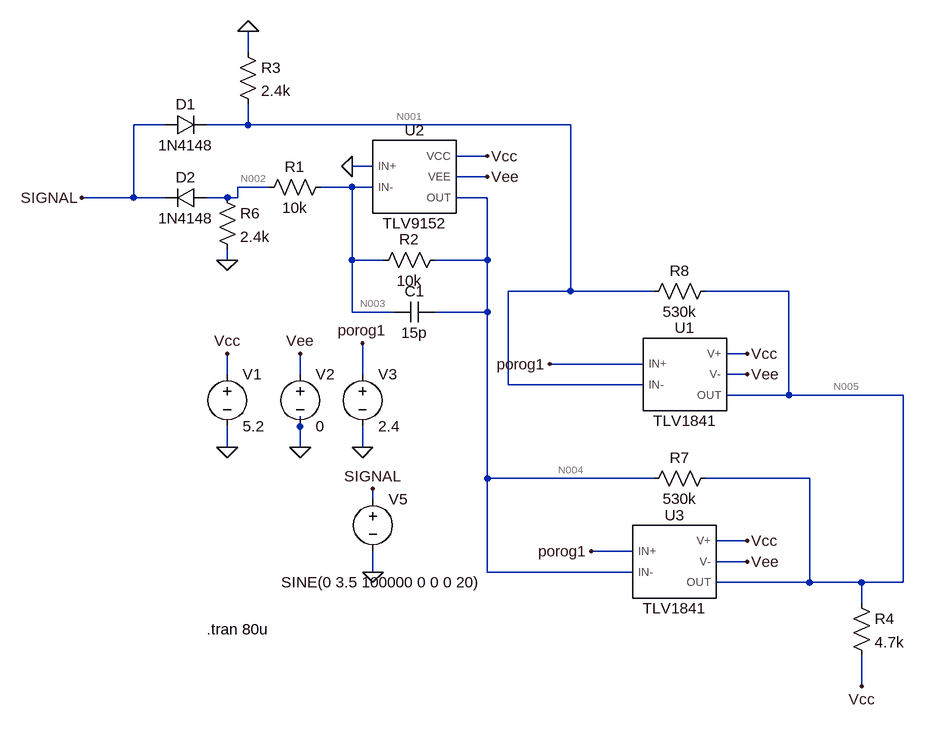
[diagram p0: schematic COmp.asc]
COmp.asc, the LTspice schematic file:
Version 4.1
SHEET 1 880 680
WIRE -528 -384 -528 -416
WIRE -656 -272 -704 -272
WIRE -528 -272 -528 -304
WIRE -528 -272 -592 -272
WIRE -32 -272 -528 -272
WIRE -160 -224 -208 -224
WIRE -336 -208 -368 -208
WIRE -160 -192 -208 -192
WIRE -496 -176 -544 -176
WIRE -368 -176 -416 -176
WIRE -336 -176 -368 -176
WIRE -704 -160 -704 -272
WIRE -704 -160 -784 -160
WIRE -656 -160 -704 -160
WIRE -560 -160 -592 -160
WIRE -544 -160 -544 -176
WIRE -544 -160 -560 -160
WIRE -160 -160 -208 -160
WIRE -560 -64 -560 -80
WIRE -368 -64 -368 -176
WIRE -320 -64 -368 -64
WIRE -160 -64 -160 -160
WIRE -160 -64 -240 -64
WIRE -32 -16 -32 -272
WIRE -32 -16 -128 -16
WIRE 96 -16 -32 -16
WIRE 304 -16 176 -16
WIRE -368 16 -368 -64
WIRE -304 16 -368 16
WIRE -160 16 -160 -64
WIRE -160 16 -240 16
WIRE 240 80 208 80
WIRE 80 96 -64 96
WIRE -560 112 -560 80
WIRE -448 112 -448 80
WIRE -352 112 -352 64
WIRE 240 112 208 112
WIRE -128 128 -128 -16
WIRE 80 128 -128 128
WIRE 304 144 304 -16
WIRE 304 144 208 144
WIRE 480 144 304 144
WIRE -448 192 -448 176
WIRE -560 224 -560 192
WIRE -448 224 -448 192
WIRE -352 224 -352 192
WIRE -160 272 -160 16
WIRE 96 272 -160 272
WIRE 336 272 176 272
WIRE -336 304 -336 288
WIRE 240 368 192 368
WIRE 64 384 0 384
WIRE 240 400 192 400
WIRE -336 416 -336 384
WIRE -160 416 -160 272
WIRE 64 416 -160 416
WIRE 336 432 336 272
WIRE 336 432 192 432
WIRE 416 432 336 432
WIRE 480 432 480 144
WIRE 480 432 416 432
WIRE 416 464 416 432
WIRE 416 592 416 544
FLAG -560 224 0
FLAG -448 224 0
FLAG -352 224 0
FLAG -560 80 Vcc
FLAG -448 80 Vee
FLAG -352 64 porog1
FLAG -336 288 SIGNAL
FLAG -336 416 0
FLAG -64 96 porog1
FLAG 240 80 Vcc
FLAG -368 -208 0
FLAG -784 -160 SIGNAL
FLAG 0 384 porog1
FLAG 240 112 Vee
FLAG 240 400 Vee
FLAG 240 368 Vcc
FLAG -160 -224 Vcc
FLAG -160 -192 Vee
FLAG -528 -416 0
FLAG -560 -64 0
FLAG 416 592 Vcc
DATAFLAG 368 144 ""
DATAFLAG 288 432 ""
DATAFLAG -368 -272 ""
DATAFLAG -160 -16 ""
DATAFLAG -576 -160 ""
DATAFLAG -736 -160 ""
DATAFLAG 16 128 ""
SYMBOL voltage -560 96 R0
WINDOW 123 0 0 Left 0
WINDOW 39 0 0 Left 0
SYMATTR InstName V1
SYMATTR Value 5.2
SYMBOL voltage -448 96 R0
WINDOW 123 0 0 Left 0
WINDOW 39 0 0 Left 0
SYMATTR InstName V2
SYMATTR Value 0
SYMBOL voltage -352 96 R0
WINDOW 123 0 0 Left 0
WINDOW 39 0 0 Left 0
SYMATTR InstName V3
SYMATTR Value 2.4
SYMBOL voltage -336 288 R0
WINDOW 123 0 0 Left 0
WINDOW 39 0 0 Left 0
WINDOW 3 -141 144 Left 2
SYMATTR InstName V5
SYMATTR Value SINE(0 3.5 100000 0 0 0 20)
SYMBOL TLV1841 144 112 R0
SYMATTR InstName U1
SYMBOL TLV9152 -272 -192 R0
SYMATTR InstName U2
SYMBOL res -400 -192 R90
WINDOW 0 0 56 VBottom 2
WINDOW 3 32 56 VTop 2
SYMATTR InstName R1
SYMATTR Value 10k
SYMBOL diode -656 -256 R270
WINDOW 0 32 32 VTop 2
WINDOW 3 0 32 VBottom 2
SYMATTR InstName D1
SYMATTR Value 1N4148
SYMBOL diode -592 -176 R90
WINDOW 0 0 32 VBottom 2
WINDOW 3 32 32 VTop 2
SYMATTR InstName D2
SYMATTR Value 1N4148
SYMBOL TLV1841 128 400 R0
SYMATTR InstName U3
SYMBOL res -224 -80 R90
WINDOW 0 0 56 VBottom 2
WINDOW 3 32 56 VTop 2
SYMATTR InstName R2
SYMATTR Value 10k
SYMBOL res -544 -400 R0
SYMATTR InstName R3
SYMATTR Value 2.4k
SYMBOL res 400 448 R0
SYMATTR InstName R4
SYMATTR Value 4.7k
SYMBOL res -576 -176 R0
SYMATTR InstName R6
SYMATTR Value 2.4k
SYMBOL cap -240 0 R90
WINDOW 0 0 32 VBottom 2
WINDOW 3 32 32 VTop 2
SYMATTR InstName C1
SYMATTR Value 15p
SYMBOL res 192 256 R90
WINDOW 0 0 56 VBottom 2
WINDOW 3 32 56 VTop 2
SYMATTR InstName R7
SYMATTR Value 530k
SYMBOL res 192 -32 R90
WINDOW 0 0 56 VBottom 2
WINDOW 3 32 56 VTop 2
SYMATTR InstName R8
SYMATTR Value 530k
TEXT -592 504 Left 2 !.tran 80u

The netlist it stands for:
* COmp.asc
V1 Vcc 0 5.2
V2 Vee 0 0
V3 porog1 0 2.4
V5 SIGNAL 0 SINE(0 3.5 100000 0 0 0 20)
X§U1 porog1 N001 Vcc Vee N005 TLV1841  ; pins IN+ IN- V+ V- OUT
X§U2 0 N003 Vcc Vee N004 TLV9152  ; pins IN+ IN- VCC VEE OUT
R1 N003 N002 10k
D1 SIGNAL N001 1N4148
D2 N002 SIGNAL 1N4148
X§U3 porog1 N004 Vcc Vee N005 TLV1841  ; pins IN+ IN- V+ V- OUT
R2 N004 N003 10k
R3 0 N001 2.4k
R4 N005 Vcc 4.7k
R6 N002 0 2.4k
C1 N004 N003 15p
R7 N005 N004 530k
R8 N005 N001 530k
.model D D
.lib standard.dio
.tran 80u
.lib C:\Users\User\Documents\LTspice\tlv1841.lib
.lib tlv9152.lib
.backanno
.end

* Results of the author's LTspice run, read from the files saved beside the schematic
* Operating Point, zero values left out:
*   V(n001) = 23.03 mV
*   V(n003) = 123.5 µV
*   V(vcc) = 5.2 V
*   V(porog1) = 2.4 V
*   V(n005) = 5.11 V
*   V(n004) = 223 µV
*   V(n002) = 23.9 µV
*   I(V1) = -729.2 µA
*   I(R2) = 9.947 nA
*   I(R4) = -19.24 µA
*   I(R7) = 9.64 µA
*   I(V3) = -999.2 pA
*   I(D1) = -1.004 nA
*   I(D2) = 1.33 pA
*   I(V5) = 1.005 nA
*   I(R3) = -9.596 µA
*   I(R6) = 9.959 nA
*   I(R8) = 9.597 µA
*   I(V2) = 719.6 µA
*   I(R1) = 9.96 nA
*   Ix(u2:in+) = -3 pA
*   Ix(u2:in-) = -13 pA
*   Ix(u2:vcc) = 560 µA
*   Ix(u2:vee) = -569.6 µA
*   Ix(u2:out) = 9.63 µA
*   Ix(u1:in+) = 499.6 pA
*   Ix(u1:in-) = 494.8 pA
*   Ix(u1:v+) = 75 µA
*   Ix(u1:v-) = -75 µA
*   Ix(u1:out) = 15.99 pA
*   Ix(u3:in+) = 499.6 pA
*   Ix(u3:in-) = 494.8 pA
*   Ix(u3:v+) = 75 µA
*   Ix(u3:v-) = -75 µA
*   Ix(u3:out) = 15.99 pA
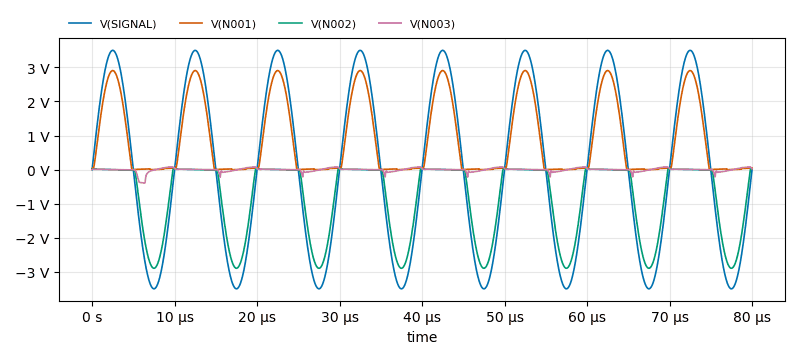
[diagram p1: Transient Analysis of COmp.asc, plotted from the saved traces]
* Transient Analysis, 1 run:
*   V(SIGNAL): min -3.5 V, max 3.5 V, average -513.8 nV, rms 2.475 V, last 0 V
*   V(N001): min -3.446 mV, max 2.906 V, average 855.9 mV, rms 1.39 V, last 43.5 mV
*   V(N002): min -2.897 V, max 30.89 mV, average -842.1 mV, rms 1.384 V, last 22.3 mV
*   V(N003): min -394.3 mV, max 78.4 mV, average -4.134 mV, rms 59.05 mV, last 24.27 mV